# EAGLE design shield_schematic (EAGLE 7.4.0)
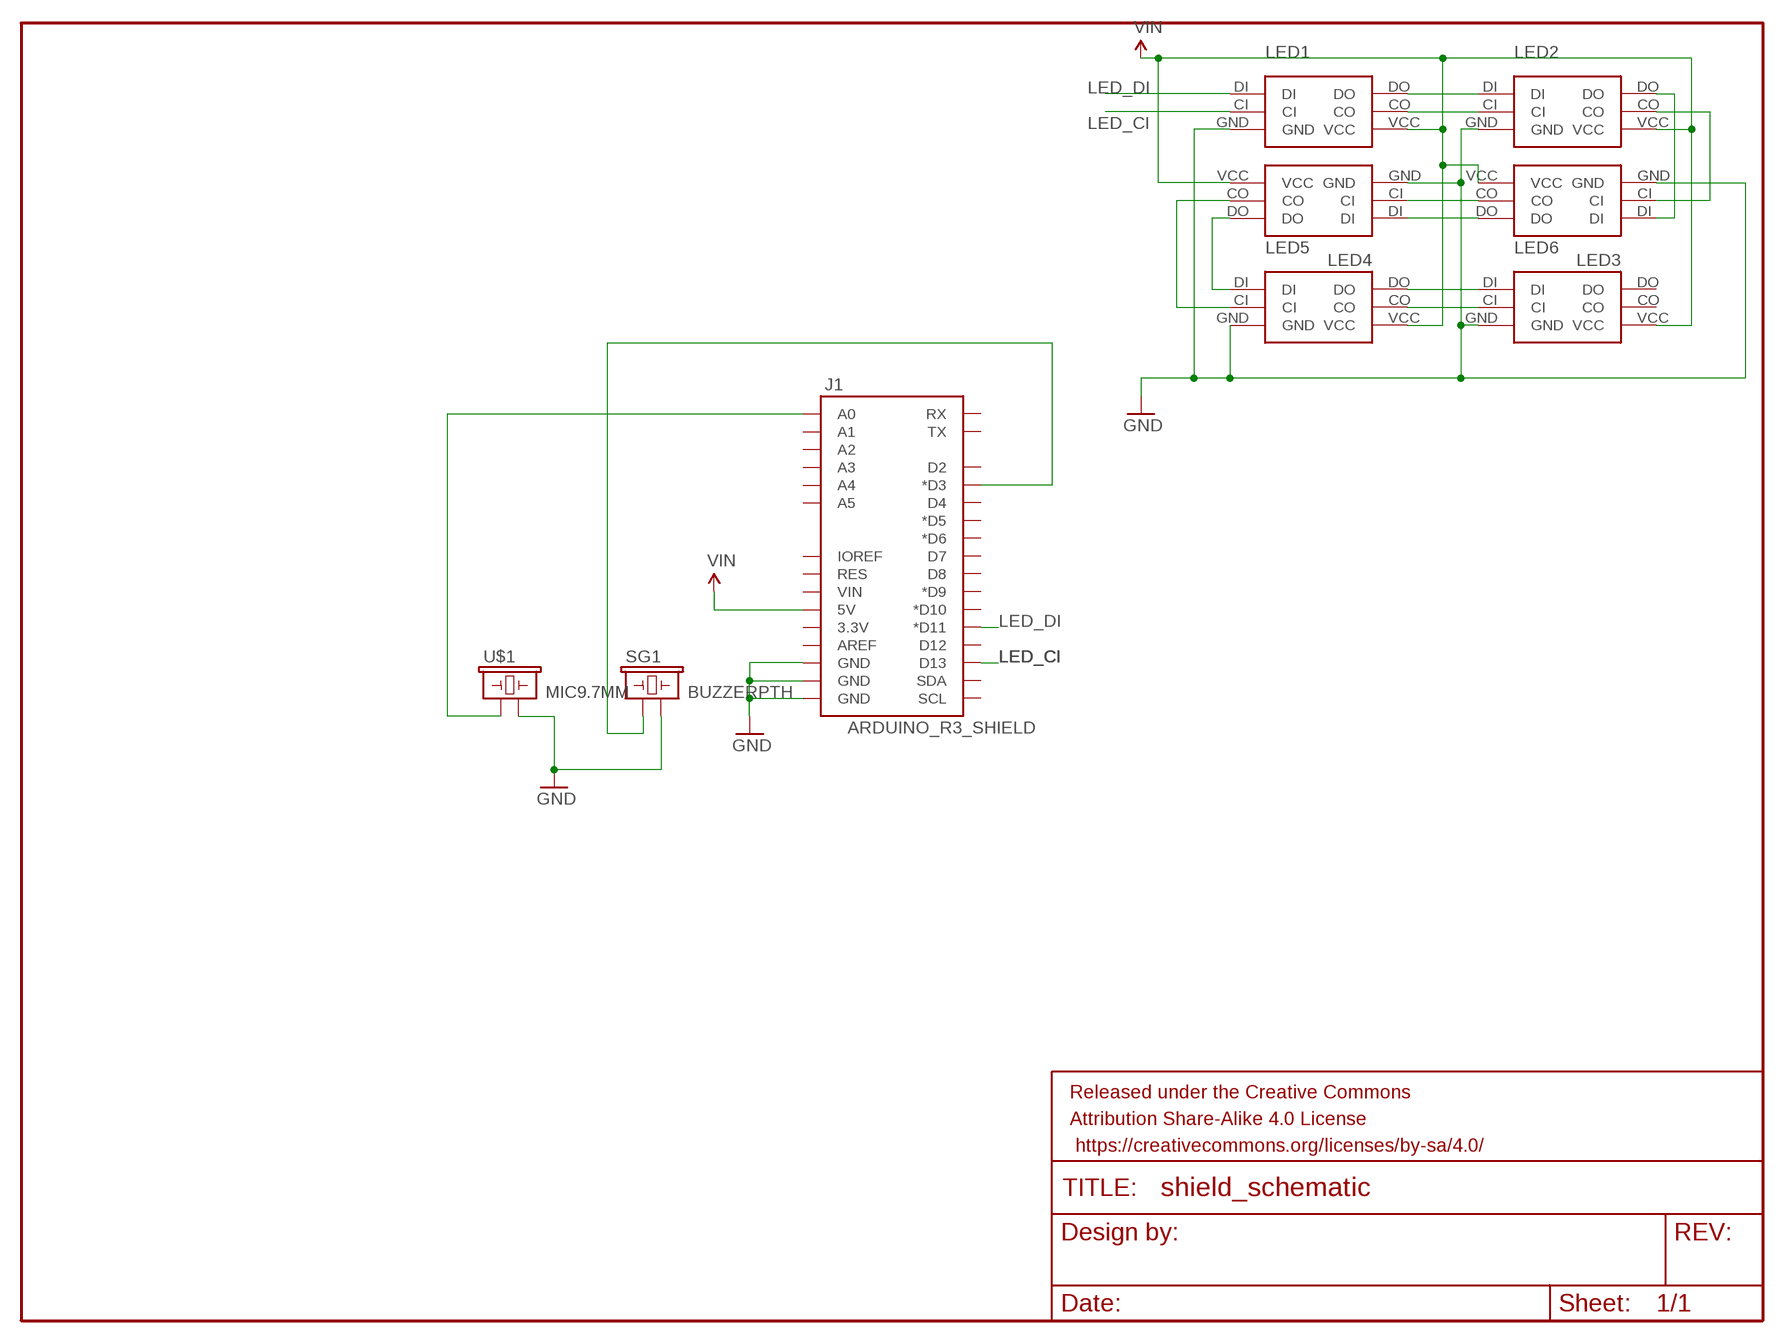
[diagram p0: schematic, sheet 1]

## Parts
FRAME1  FRAME-LETTER  [CREATIVE_COMMONS]
J1  ARDUINO_R3_SHIELD  [UNO_R3_SHIELD]
LED1  APA102SMD  [RGBLED5050]
LED2  APA102SMD  [RGBLED5050]
LED3  APA102SMD  [RGBLED5050]
LED4  APA102SMD  [RGBLED5050]
LED5  APA102SMD  [RGBLED5050]
LED6  APA102SMD  [RGBLED5050]
SG1  BUZZERPTH  [BUZZER-12MM]
U$1  MIC9.7MM  [MIC-9.7MM]

## Nets
GND: J1.GND@0(GND) J1.GND@1(GND) J1.GND@2(GND) LED1.GND LED2.GND LED3.GND LED4.GND LED5.GND LED6.GND SG1.- U$1.2
LED_CI: J1.D13 LED1.CI
LED_DI: J1.D11(*D11) LED1.DI
N$1: J1.A0 U$1.1
N$3: J1.D3(*D3) SG1.+
N$14: LED1.DO LED2.DI
N$15: LED1.CO LED2.CI
N$16: LED2.DO LED3.DI
N$17: LED2.CO LED3.CI
N$18: LED3.CO LED4.CI
N$19: LED3.DO LED4.DI
N$20: LED4.CO LED5.CI
N$21: LED4.DO LED5.DI
N$22: LED5.DO LED6.DI
N$23: LED5.CO LED6.CI
VIN: J1.5V LED1.VCC LED2.VCC LED3.VCC LED4.VCC LED5.VCC LED6.VCC
Unconnected: J1.3.3V J1.A1 J1.A2 J1.A3 J1.A4 J1.A5 J1.AREF J1.D2 J1.D4 J1.D5(*D5) J1.D6(*D6) J1.D7 J1.D8 J1.D9(*D9) J1.D10(*D10) J1.D12 J1.IOREF J1.RES J1.RX J1.SCL J1.SDA J1.TX J1.VIN LED6.CO LED6.DO

## Library data of the parts
FRAME1 = SparkFun-Aesthetics:FRAME-LETTER: Schematic Frame Standard 8.5x11 US Letter frame
J1 = SparkFun-Boards:ARDUINO_R3_SHIELD: Shield form compatible with the Arduino Uno R3.
LED1-LED6 = Arduino_Shield:APA102
SG1 = SparkFun-Electromechanical:BUZZER: Buzzer 12mm Spark Fun Electronics SKU : Comp-Buzzer
U$1 = SparkFun-Sensors:MIC: Omni-directional electret microphone. 9.7mm standard diameter.; PROD_ID: COMP-08856

## Board
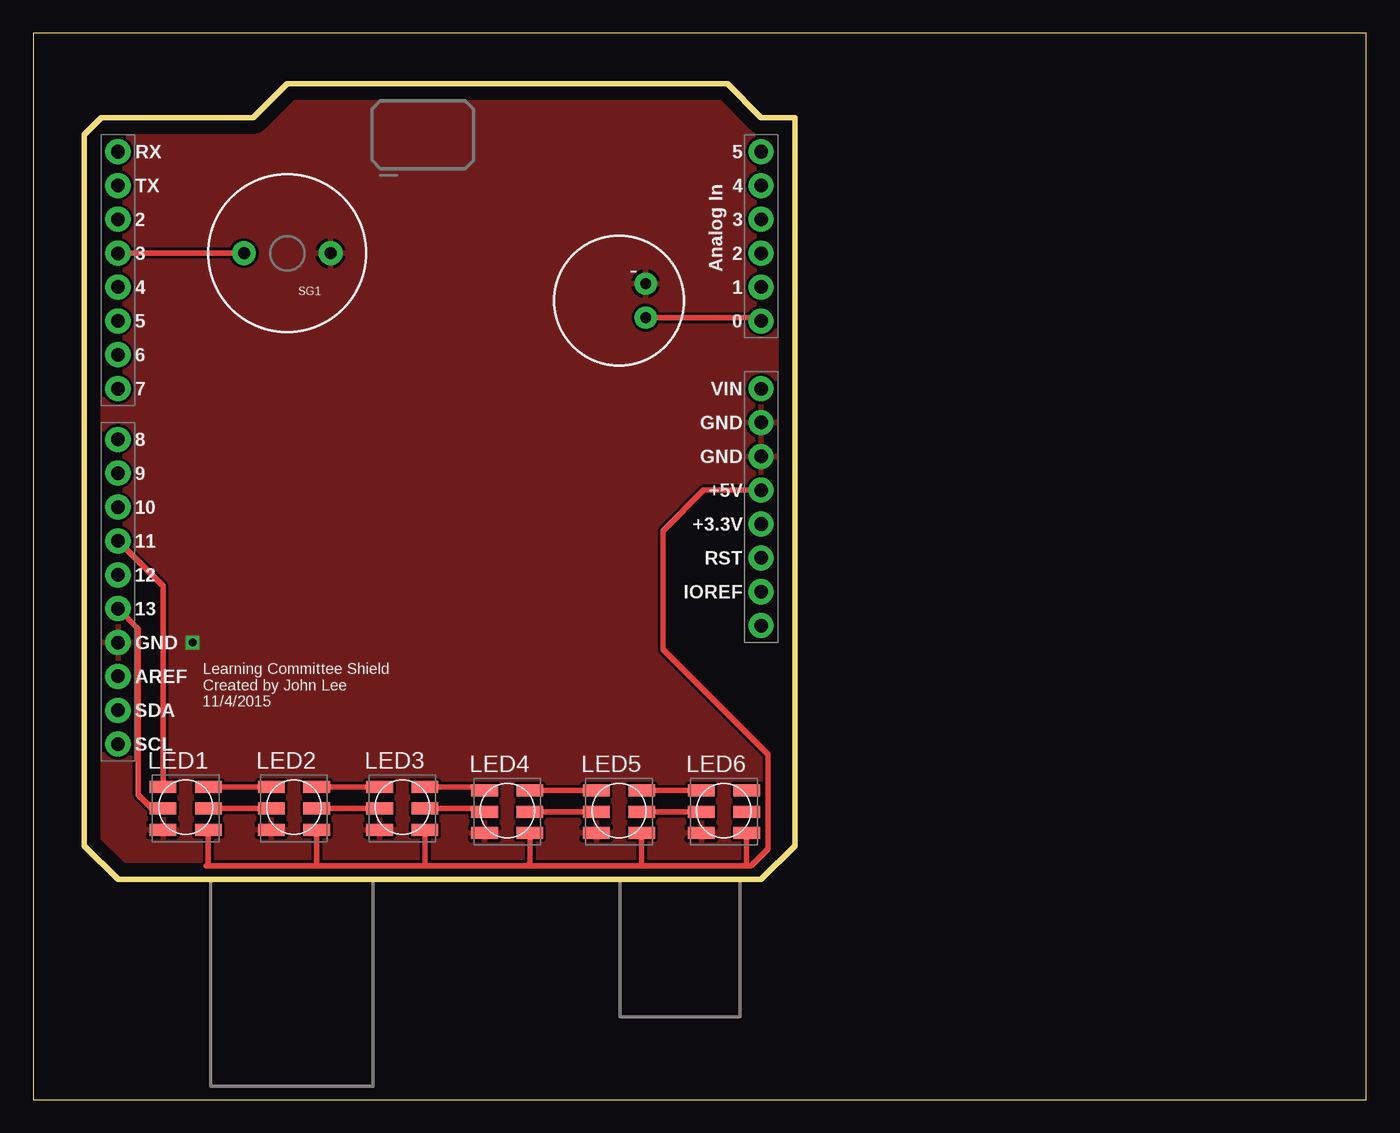
[diagram p1: board, top side]
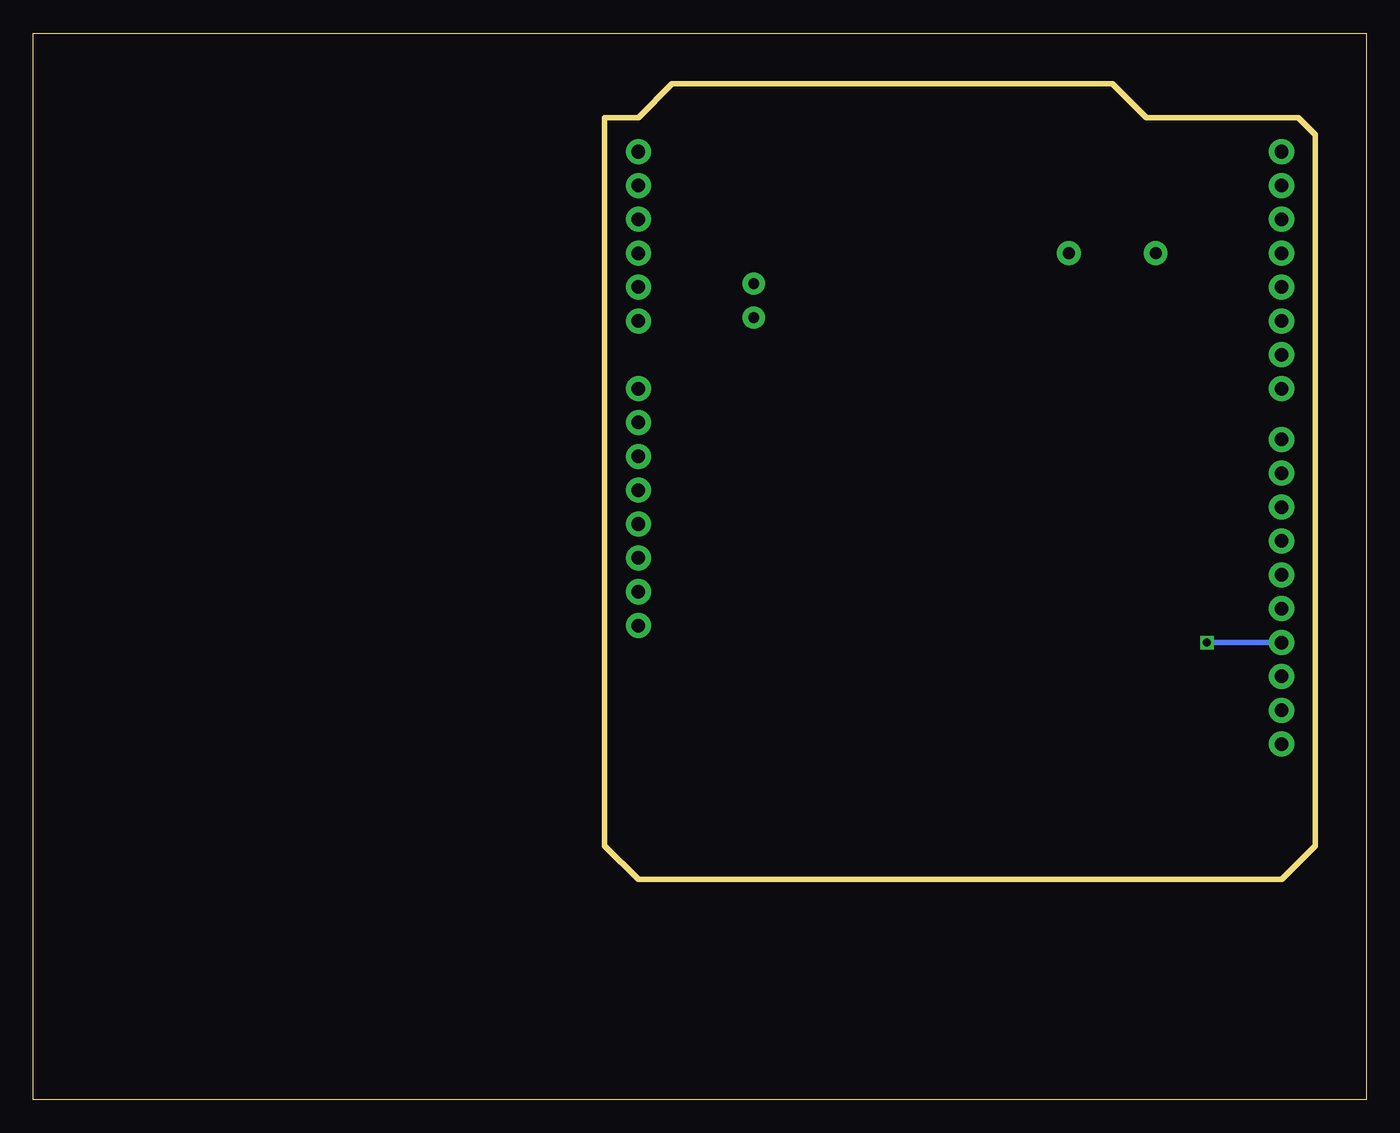
[diagram p2: board, bottom side, seen from below]

Size 100 x 80 mm. Coordinates in mm from the lower left corner, seen from the top.
Outline: 0,0 100,0 100,80 0,80 0,0
Outline: 3.81,19.05 3.81,72.39 5.08,73.66 16.51,73.66 19.05,76.2 52.07,76.2 54.61,73.66 57.15,73.66 57.15,19.05 54.61,16.51 6.35,16.51 3.81,19.05
Copper layers (1*16): Top 0.035mm / dielectric 1.5mm / Bottom 0.035mm
Design rules "default": minimum track width 10mil, minimum drill 24mil, track to track 8mil, track to pad 8mil, pad to pad 8mil, via to via 8mil, smd to smd 8mil, copper to edge 40mil, drill to drill 8mil, minimum pad ring 10mil, minimum via ring 8mil, stop-mask expansion 4mil, vias tented up to drill 0mil, thermal gap 10mil

### Footprints (pad centres in the part's own frame; a part is rotated, then mirrored left to right if it is on the bottom)
UNO_R3_SHIELD = drill 1.016 pad 1.88: 3.3V 50.8,26.67; 5V 50.8,29.21; A0 50.8,41.91; A1 50.8,44.45; A2 50.8,46.99; A3 50.8,49.53; A4 50.8,52.07; A5 50.8,54.61; AREF 2.54,15.24; D2 2.54,49.53; D3 2.54,46.99; D4 2.54,44.45; D5 2.54,41.91; D6 2.54,39.37; D7 2.54,36.83; D8 2.54,33.02; D9 2.54,30.48; D10 2.54,27.94; D11 2.54,25.4; D12 2.54,22.86; D13 2.54,20.32; GND@0 50.8,31.75; GND@1 50.8,34.29; GND@2 2.54,17.78; IOREF 50.8,21.59; NC 50.8,19.05; RES 50.8,24.13; RX 2.54,54.61; SCL 2.54,10.16; SDA 2.54,12.7; TX 2.54,52.07; VIN 50.8,36.83
RGBLED5050 = smd 2 x 0.9: CI -1.7,0; CO 1.7,0; DI -1.7,1.6; DO 1.7,1.6; GND -1.7,-1.6; VCC 1.7,-1.6
BUZZER-12MM = drill 0.9 pad 1.778: + 3.25,0; - -3.25,0
MIC-9.7MM = drill 0.8 pad 1.676: 1 -2,1.27; 2 -2,-1.27

### Placement (x,y rotation side)
FRAME1  -101.6,77.47 0 top  (outside the outline)
J1  3.81,16.51 0 top
LED1  11.43,21.84 0 top
LED2  19.56,21.84 0 top
LED3  27.69,21.84 0 top
LED4  35.56,21.59 0 top
LED5  43.94,21.59 0 top
LED6  51.82,21.59 0 top
SG1  19.05,63.5 180 top
U$1  43.94,59.94 180 top

### Tracks (layer width: path | path; a pad name or v marks a point on that pad's centre or on a via)
GND  (via drill 0.6)
  Bottom 0.406: J1.GND@2 v11.94,34.29
  pour Top: 3.81,19.05 3.81,72.39 5.08,73.66 16.51,73.66 19.05,76.2 52.07,76.2 54.61,73.66 57.15,73.66 57.15,19.05 54.61,16.51 6.35,16.51
LED_CI
  Top 0.406: LED1.CI 8.89,21.84 7.87,22.86 7.87,35.31 J1.D13
LED_DI
  Top 0.406: LED1.DI 9.73,38.53 J1.D11
N$1
  Top 0.406: U$1.1 54.36,58.67 J1.A0
N$3
  Top 0.406: SG1.+ J1.D3
N$14
  Top 0.406: LED1.DO LED2.DI
N$15
  Top 0.406: LED1.CO LED2.CI
N$16
  Top 0.406: LED2.DO LED3.DI
N$17
  Top 0.406: LED2.CO LED3.CI
N$18
  Top 0.406: LED3.CO 33.61,21.84 LED4.CI
N$19
  Top 0.406: LED3.DO 33.61,23.44 LED4.DI
N$20
  Top 0.406: LED4.CO LED5.CI
N$21
  Top 0.406: LED4.DO LED5.DI
N$22
  Top 0.406: LED5.DO LED6.DI
N$23
  Top 0.406: LED5.CO LED6.CI
VIN
  Top 0.406: J1.5V 50.29,45.72 47.24,42.67 47.24,33.78 55.12,25.91 55.12,18.8 53.85,17.53 53.59,17.53 | 53.59,17.53 45.72,17.53 | 45.72,17.53 37.08,17.53 | 37.08,17.53 29.46,17.53 | 29.46,17.53 21.34,17.53 | 21.34,17.53 12.95,17.53 13.13,17.7 LED1.VCC | LED2.VCC 21.26,17.6 21.34,17.53 | LED5.VCC 45.64,17.6 45.72,17.53 | LED6.VCC 53.52,17.6 53.59,17.53 | LED4.VCC 37.26,17.7 37.08,17.53 | LED3.VCC 29.39,17.6 29.46,17.53

### Text on the board
tPlace: Learning Committee Shield / Created by John Lee / 11/4/2015